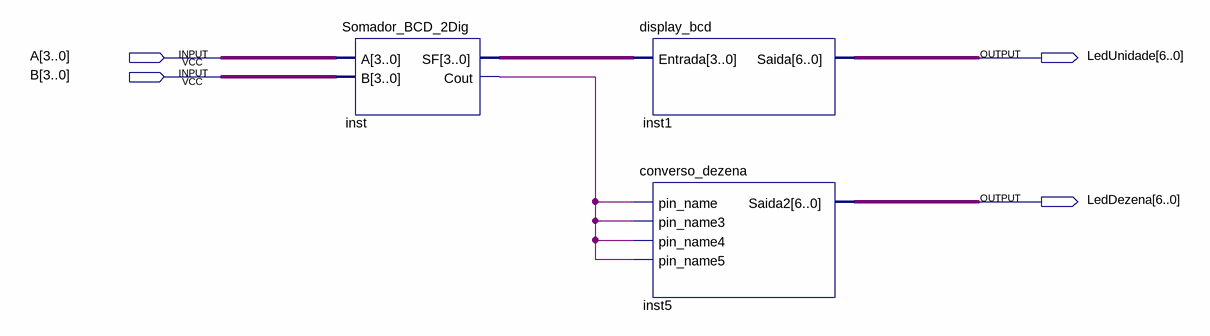
[diagram p0: schematic sheet]
// Quartus schematic MAIN_BCD.bdf as structural Verilog: 3 symbols, 4 pins
module MAIN_BCD (
  input  [3:0] A,
  input  [3:0] B,
  output [6:0] LedUnidade,
  output [6:0] LedDezena
);

  wire inst_cout;
  wire [3:0] inst_sf;

  Somador_BCD_2Dig inst (.A(A), .B(B), .SF(inst_sf), .Cout(inst_cout));
  display_bcd inst1 (.Entrada(inst_sf), .Saida(LedUnidade));
  converso_dezena inst5 (
    .pin_name(inst_cout), .pin_name3(inst_cout), .pin_name4(inst_cout), .pin_name5(inst_cout),
    .Saida2(LedDezena));
endmodule
